# Altium schematic sheet Alimentations.SchDoc
size A4
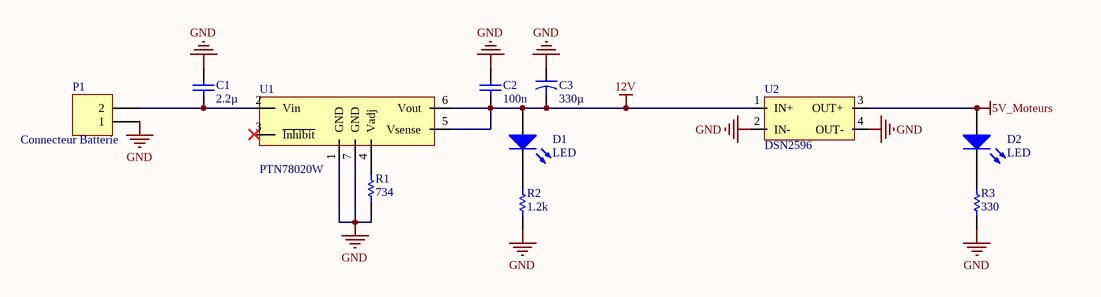
[diagram p0: Alimentations.SchDoc]

## Parts
C1  value 2.2µ  [RAD-0.3]  (hidden comment: Cap)
C2  value 100n  [RAD-0.3]  (hidden comment: Cap)
C3  value 330µ  [CAPR5-4X5]  (hidden comment: Cap2)
D1  LED  [C0805]
D2  LED  [C0805]
P1  Connecteur Batterie  [HDR1X2]
R1  value 734  [AXIAL-0.3]  (hidden comment: Res1)
R2  value 1.2k  [AXIAL-0.3]  (hidden comment: Res1)
R3  value 330  [AXIAL-0.3]  (hidden comment: Res1)
U1  PTN78020W
U2  DSN2596

## Nets
5V_Moteurs: D2.1(A) U2.3(OUT+)
12V: C2.1 C3.2 D1.1(A) U1.5(Vsense) U1.6(Vout) U2.1(IN+)
GND: C1.2 C2.2 C3.1 P1.1 R1.1 R2.2 R3.2 U1.1(GND) U1.7(GND) U2.2(IN-) U2.4(OUT-)
NetC1_1: C1.1 P1.2 U1.2(Vin)
NetD1_2: D1.2(K) R2.1
NetD2_2: D2.2(K) R3.1
NetR1_2: R1.2 U1.4(Vadj)

Not connected (* = marked no-connect by the designer): U1 3(~{Inhibit})*

## Library data of the parts
C1 = Cap: 2.2µ; Published: 8-Jun-2000; LatestRevisionDate: 17-Jul-2002; LatestRevisionNote: Re-released for DXP Platform.; PackageReference: RAD-0.3; Publisher: Altium Limited
C2 = Cap: 100n; Published: 8-Jun-2000; LatestRevisionDate: 17-Jul-2002; LatestRevisionNote: Re-released for DXP Platform.; PackageReference: RAD-0.3; Publisher: Altium Limited
C3 = Cap2: 330µ; Published: 23-Sep-2002; PackageReference: CAPR5-4X5; Publisher: Altium Limited
D1 = LED1: LED Bleu; Published: 8-Jun-2000; LatestRevisionDate: 08-Jul-2005; LatestRevisionNote: Mech Layer 1 removed.; PackageReference: LED-1; Publisher: Altium Limited
D2 = LED1: LED Verte; Published: 8-Jun-2000; LatestRevisionDate: 08-Jul-2005; LatestRevisionNote: Mech Layer 1 removed.; PackageReference: LED-1; Publisher: Altium Limited
P1 = Header 2: Header, 2-Pin; LatestRevisionDate: 17-Jul-2002; LatestRevisionNote: Re-released for DXP Platform.; Publisher: Altium Limited
R1 = Res1: 734R 1%; Published: 8-Jun-2000; LatestRevisionDate: 17-Jul-2002; LatestRevisionNote: Re-released for DXP Platform.; PackageReference: AXIAL-0.3; Publisher: Altium Limited
R2 = Res1: 1.2k; Published: 8-Jun-2000; LatestRevisionDate: 17-Jul-2002; LatestRevisionNote: Re-released for DXP Platform.; PackageReference: AXIAL-0.3; Publisher: Altium Limited
R3 = Res1: 330R; Published: 8-Jun-2000; LatestRevisionDate: 17-Jul-2002; LatestRevisionNote: Re-released for DXP Platform.; PackageReference: AXIAL-0.3; Publisher: Altium Limited
U1 = PTN78020W: Alim à découpage 6A
U2 = DSN2596: Module Buck 24V 12V 5V - 3A